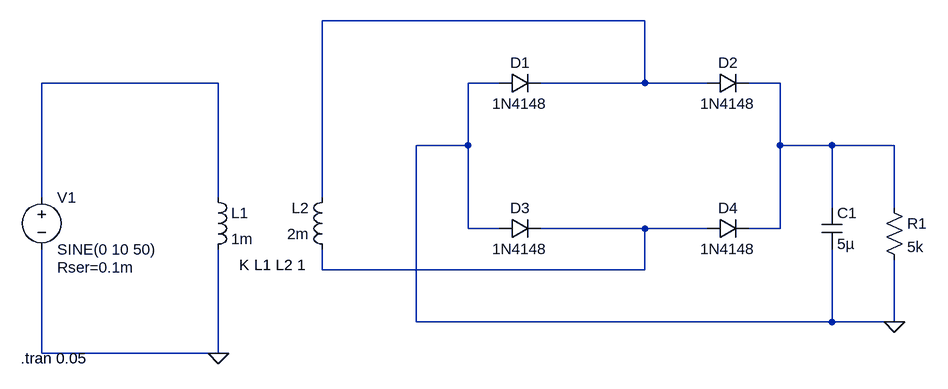
[diagram p0: schematic Full Wave Rectifier.asc]
Full Wave Rectifier.asc, the LTspice schematic file:
Version 4.1
SHEET 1 880 680
WIRE 320 16 -176 16
WIRE -336 112 -608 112
WIRE 96 112 48 112
WIRE 320 112 320 16
WIRE 320 112 160 112
WIRE 416 112 320 112
WIRE 528 112 480 112
WIRE 48 208 48 112
WIRE 48 208 -32 208
WIRE 528 208 528 112
WIRE 608 208 528 208
WIRE 704 208 608 208
WIRE -608 288 -608 112
WIRE -336 288 -336 112
WIRE -176 288 -176 16
WIRE 608 304 608 208
WIRE 704 304 704 208
WIRE 48 336 48 208
WIRE 96 336 48 336
WIRE 320 336 160 336
WIRE 416 336 320 336
WIRE 528 336 528 208
WIRE 528 336 480 336
WIRE -176 400 -176 368
WIRE 320 400 320 336
WIRE 320 400 -176 400
WIRE -32 480 -32 208
WIRE 608 480 608 368
WIRE 608 480 -32 480
WIRE 704 480 704 384
WIRE 704 480 608 480
WIRE -608 528 -608 368
WIRE -336 528 -336 368
WIRE -336 528 -608 528
FLAG -336 528 0
FLAG 704 480 0
SYMBOL diode 96 128 R270
WINDOW 0 32 32 VTop 2
WINDOW 3 0 32 VBottom 2
SYMATTR InstName D1
SYMATTR Value 1N4148
SYMBOL diode 416 128 R270
WINDOW 0 32 32 VTop 2
WINDOW 3 0 32 VBottom 2
SYMATTR InstName D2
SYMATTR Value 1N4148
SYMBOL diode 96 352 R270
WINDOW 0 32 32 VTop 2
WINDOW 3 0 32 VBottom 2
SYMATTR InstName D3
SYMATTR Value 1N4148
SYMBOL diode 416 352 R270
WINDOW 0 32 32 VTop 2
WINDOW 3 0 32 VBottom 2
SYMATTR InstName D4
SYMATTR Value 1N4148
SYMBOL res 688 288 R0
SYMATTR InstName R1
SYMATTR Value 5k
SYMBOL ind -352 272 R0
SYMATTR InstName L1
SYMATTR Value 1m
SYMATTR Type ind
SYMBOL ind -160 384 R180
WINDOW 0 36 80 Left 2
WINDOW 3 36 40 Left 2
SYMATTR InstName L2
SYMATTR Value 2m
SYMATTR Type ind
SYMBOL voltage -608 272 R0
WINDOW 123 0 0 Left 0
WINDOW 39 24 124 Left 2
SYMATTR InstName V1
SYMATTR Value SINE(0 10 50)
SYMATTR SpiceLine Rser=0.1m
SYMBOL cap 592 304 R0
SYMATTR InstName C1
SYMATTR Value 5µ
TEXT -304 392 Left 2 !K L1 L2 1
TEXT -640 536 Left 2 !.tran 0.05

The netlist it stands for:
* Full Wave Rectifier.asc
D1 0 N001 1N4148
D2 N001 N003 1N4148
D3 0 N004 1N4148
D4 N004 N003 1N4148
R1 N003 0 5k
L1 N002 0 1m
L2 N004 N001 2m
V1 N002 0 SINE(0 10 50) Rser=0.1m
C1 N003 0 5µ
.model D D
.lib standard.dio
K L1 L2 1
.tran 0.05
.backanno
.end